# EAGLE design SensadoCalibradoMaquinas (EAGLE 9.6.2)
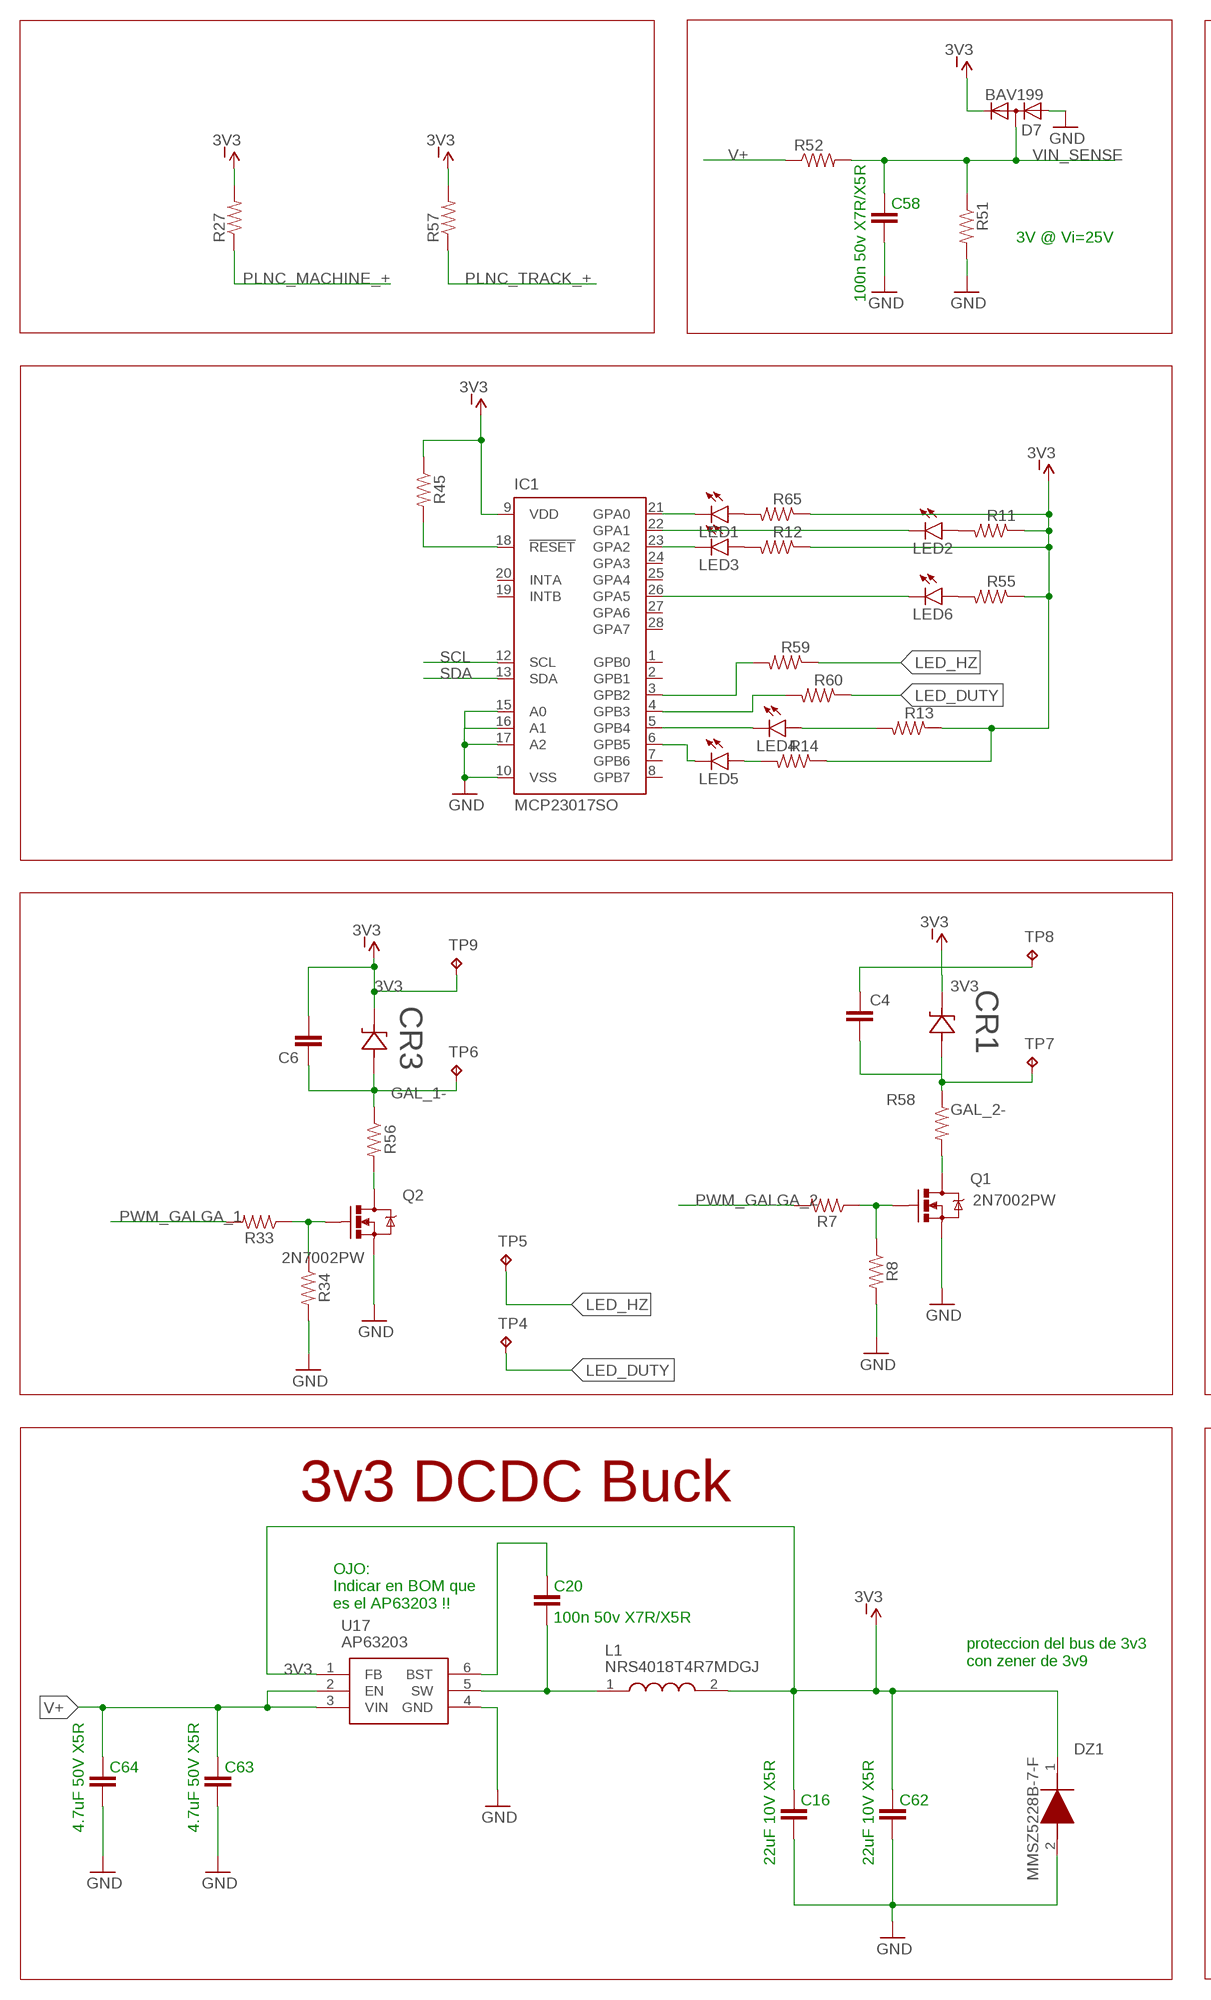
[diagram p0: schematic, sheet 1, part 1 of 2]
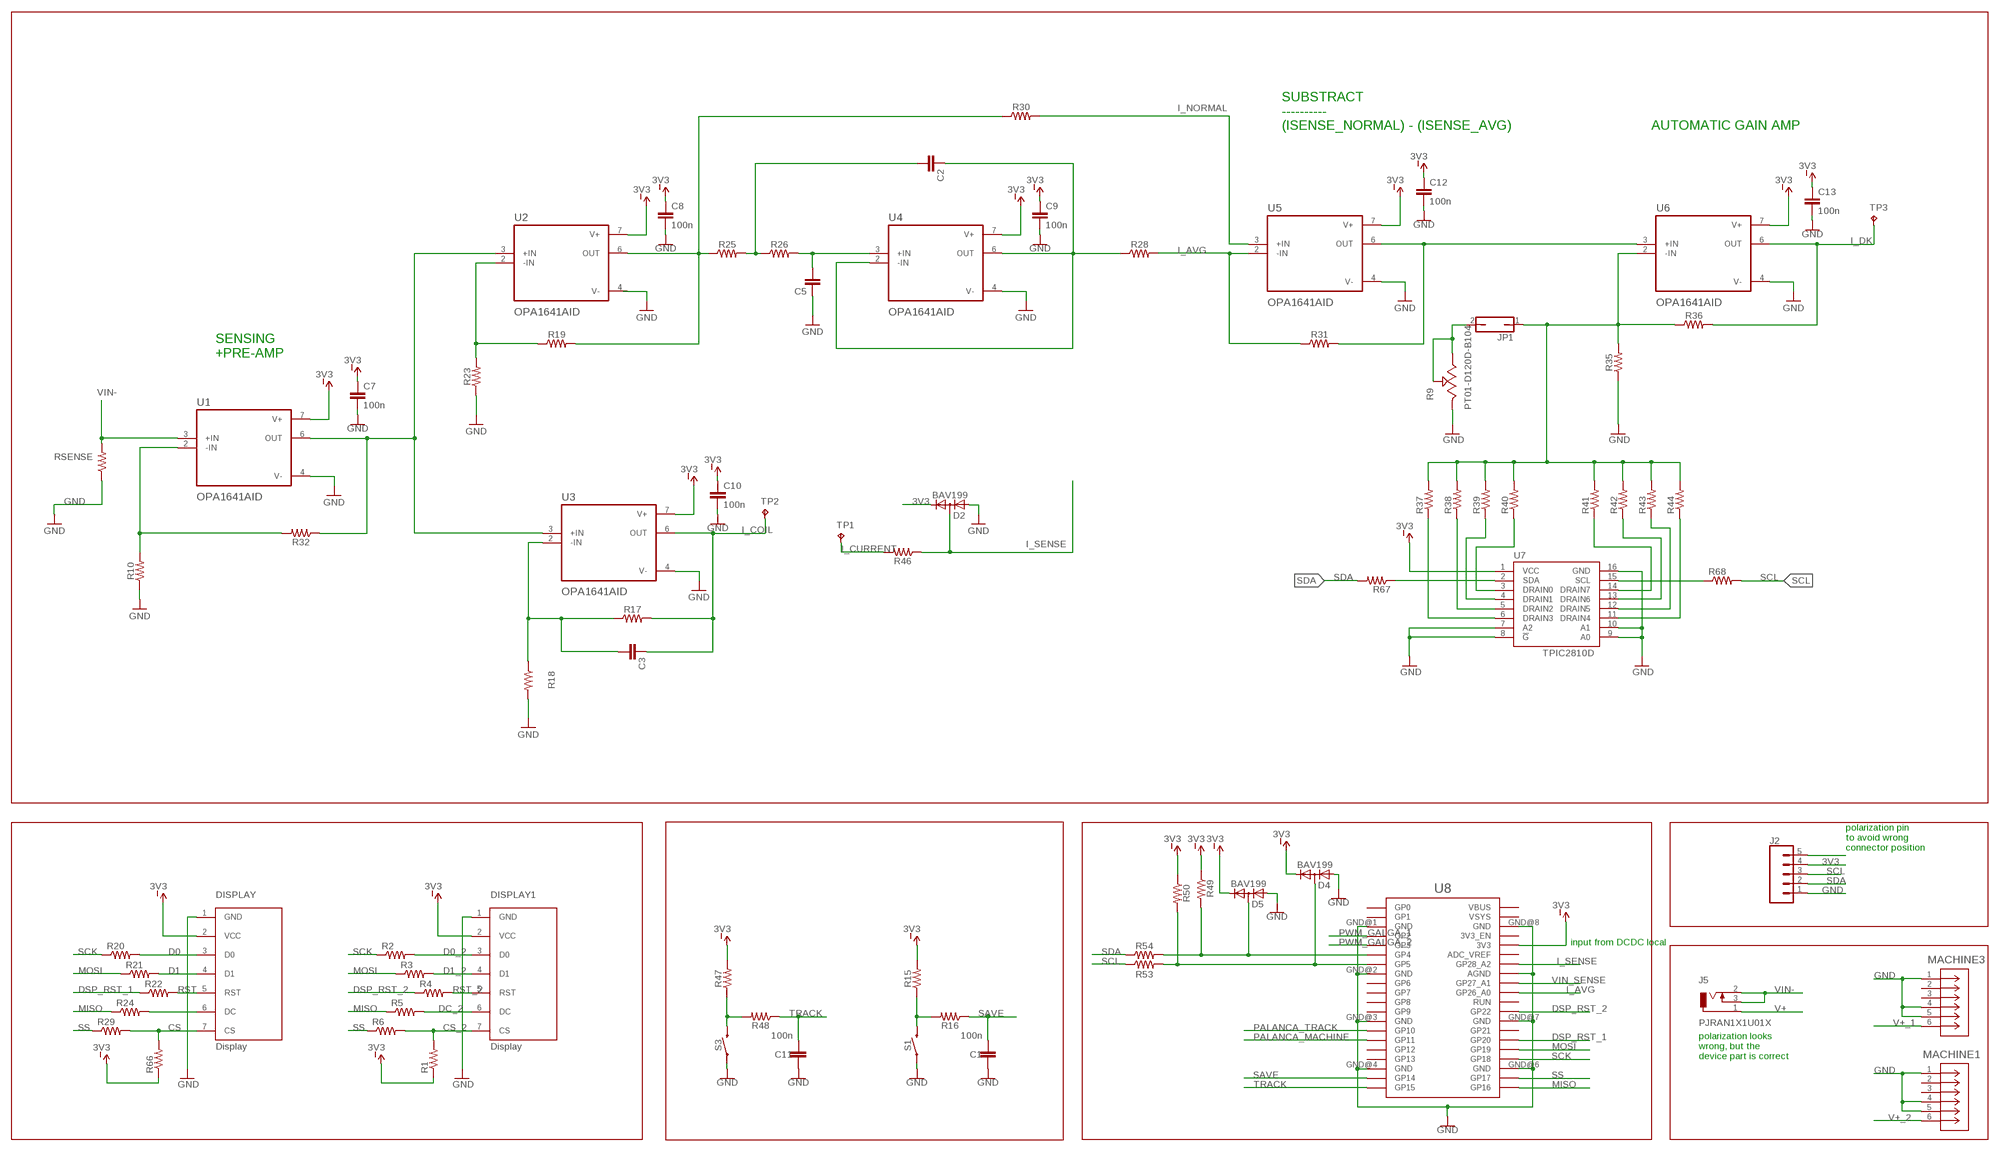
[diagram p1: schematic, sheet 1, part 2 of 2]

## Parts
C1  100n  1.0UF-0805-25V-(+80/-20%)  [0805]
C2  CAP0805  [0805]
C3  CAP0805  [0805]
C4  CAP0805  [0805]
C5  CAP0805  [0805]
C6  CAP0805  [0805]
C7  100n  1.0UF-0805-25V-(+80/-20%)  [0805]
C8  100n  1.0UF-0805-25V-(+80/-20%)  [0805]
C9  100n  1.0UF-0805-25V-(+80/-20%)  [0805]
C10  100n  1.0UF-0805-25V-(+80/-20%)  [0805]
C11  100n  1.0UF-0805-25V-(+80/-20%)  [0805]
C12  100n  1.0UF-0805-25V-(+80/-20%)  [0805]
C13  100n  1.0UF-0805-25V-(+80/-20%)  [0805]
C16  22uF 10V X5R  CAP0805  [0805]
C20  100n 50v X7R/X5R  CAP0805  [0805]
C58  100n 50v X7R/X5R  CAP0805  [0805]
C62  22uF 10V X5R  CAP0805  [0805]
C63  4.7uF 50V X5R  CAP0805  [0805]
C64  4.7uF 50V X5R  CAP0805  [0805]
CR1  STPS1L40U  [SMB_STM]
CR3  STPS1L40U  [SMB_STM]
D2  BAV199  [SOT23]
D4  BAV199  [SOT23]
D5  BAV199  [SOT23]
D7  BAV199  [SOT23]
DISPLAY  Display  OLED_LCD  [OLED_LCD]
DISPLAY1  Display  OLED_LCD  [OLED_LCD]
DZ1  MMSZ5228B-7-F  [SODFL3518X115N]
IC1  MCP23017SO  [SO28W]
J2  CONN_05  [1X05]
J5  PJRAN1X1U01X  [PJRAN1X1U01X]
JP1  JP1Q  [JP1]
L1  NRS4018T4R7MDGJ  [NRS4018T100MDGJ]
LED1  LED3MM  [LED3MM]
LED2  LED3MM  [LED3MM]
LED3  LED3MM  [LED3MM]
LED4  LED3MM  [LED3MM]
LED5  LED3MM  [LED3MM]
LED6  LED3MM  [LED3MM]
MACHINE1  ACJS-MHDR  [CONN_MHDR_AMP]
MACHINE3  ACJS-MHDR  [CONN_MHDR_AMP]
Q1  2N7002PW  MOSFET-NCHANNEL2N7002PW  [SOT323]
Q2  2N7002PW  MOSFET-NCHANNEL2N7002PW  [SOT323]
R1  RESISTOR0805  [0805]
R2  RESISTOR0805  [0805]
R3  RESISTOR0805  [0805]
R4  RESISTOR0805  [0805]
R5  RESISTOR0805  [0805]
R6  RESISTOR0805  [0805]
R7  RESISTOR0805  [0805]
R8  RESISTOR0805  [0805]
R9  PT01-D120D-B104  [TRIM_PT01-D120D-B104]
R10  RESISTOR0805  [0805]
R11  RESISTOR0805  [0805]
R12  RESISTOR0805  [0805]
R13  RESISTOR0805  [0805]
R14  RESISTOR0805  [0805]
R15  RESISTOR0805  [0805]
R16  RESISTOR0805  [0805]
R17  RESISTOR0805  [0805]
R18  RESISTOR0805  [0805]
R19  RESISTOR0805  [0805]
R20  RESISTOR0805  [0805]
R21  RESISTOR0805  [0805]
R22  RESISTOR0805  [0805]
R23  RESISTOR0805  [0805]
R24  RESISTOR0805  [0805]
R25  RESISTOR0805  [0805]
R26  RESISTOR0805  [0805]
R27  RESISTOR0805  [0805]
R28  RESISTOR0805  [0805]
R29  RESISTOR0805  [0805]
R30  RESISTOR0805  [0805]
R31  RESISTOR0805  [0805]
R32  RESISTOR0805  [0805]
R33  RESISTOR0805  [0805]
R34  RESISTOR0805  [0805]
R35  RESISTOR0805  [0805]
R36  RESISTOR0805  [0805]
R37  RESISTOR0805  [0805]
R38  RESISTOR0805  [0805]
R39  RESISTOR0805  [0805]
R40  RESISTOR0805  [0805]
R41  RESISTOR0805  [0805]
R42  RESISTOR0805  [0805]
R43  RESISTOR0805  [0805]
R44  RESISTOR0805  [0805]
R45  RESISTOR0805  [0805]
R46  RESISTOR0805  [0805]
R47  RESISTOR0805  [0805]
R48  RESISTOR0805  [0805]
R49  RESISTOR0805  [0805]
R50  RESISTOR0805  [0805]
R51  RESISTOR0805  [0805]
R52  RESISTOR0805  [0805]
R53  RESISTOR0805  [0805]
R54  RESISTOR0805  [0805]
R55  RESISTOR0805  [0805]
R56  RESISTOR0805  [0805]
R57  RESISTOR0805  [0805]
R58  RESISTOR0805  [0805]
R59  RESISTOR0805  [0805]
R60  RESISTOR0805  [0805]
R65  RESISTOR0805  [0805]
R66  RESISTOR0805  [0805]
R67  RESISTOR0805  [0805]
R68  RESISTOR0805  [0805]
RSENSE  RESISTORAXIAL-0.3  [AXIAL-0.3]
S1  MOMENTARY-SWITCH-SPST-SMD-5.2MM  [TACTILE_SWITCH_SMD_5.2MM]
S3  MOMENTARY-SWITCH-SPST-SMD-5.2MM  [TACTILE_SWITCH_SMD_5.2MM]
TP1  TPTP06SQ  [TP06SQ]
TP2  TPTP06SQ  [TP06SQ]
TP3  TPTP06SQ  [TP06SQ]
TP4  TPTP06SQ  [TP06SQ]
TP5  TPTP06SQ  [TP06SQ]
TP6  TPTP06SQ  [TP06SQ]
TP7  TPTP06SQ  [TP06SQ]
TP8  TPTP06SQ  [TP06SQ]
TP9  TPTP06SQ  [TP06SQ]
U1  OPA1641AID  [SOIC127P599X175-8N]
U2  OPA1641AID  [SOIC127P599X175-8N]
U3  OPA1641AID  [SOIC127P599X175-8N]
U4  OPA1641AID  [SOIC127P599X175-8N]
U5  OPA1641AID  [SOIC127P599X175-8N]
U6  OPA1641AID  [SOIC127P599X175-8N]
U7  TPIC2810D  [SO16]
U8  RPI_PICO_IG-TH  [RPI_PICO_TH]
U17  AP63203  AP63201WU-7  [SOT95P280X100-6N]

## Nets
3V3: C4.1 C6.2 C7.2 C8.2 C9.2 C10.2 C12.2 C13.2 C16.2 C62.2 CR1.2 CR3.2 D2.2(C) D4.2(C) D5.2(C) D7.2(C) DISPLAY1.2(VCC) DISPLAY.2(VCC) DZ1.1(K) IC1.9(VDD) J2.4 L1.2 R1.1 R11.1 R12.1 R13.1 R14.1 R15.2 R27.2 R45.1 R47.2 R49.1 R50.1 R55.1 R57.2 R65.1 R66.1 TP8.TP TP9.TP U1.7(V+) U2.7(V+) U3.7(V+) U4.7(V+) U5.7(V+) U6.7(V+) U7.1(VCC) U8.3V3 U17.1(FB)
CS: DISPLAY.7(CS) R29.2 R66.2
CS_2: DISPLAY1.7(CS) R1.2 R6.2
D0: DISPLAY.3(D0) R20.2
D0_2: DISPLAY1.3(D0) R2.2
D1: DISPLAY.4(D1) R21.2
D1_2: DISPLAY1.4(D1) R3.2
DC_2: DISPLAY1.6(DC) R5.2
DSP_RST_1: R22.1 U8.GP20
DSP_RST_2: R4.1 U8.GP22
GAIN: R32.1 U1.6(OUT) U2.3(+IN) U3.3(+IN)
GAL_1-: C6.1 CR3.1 R56.1 TP6.TP
GAL_2-: C4.2 CR1.1 R58.1 TP7.TP
GND: C1.1 C5.1 C7.1 C8.1 C9.1 C10.1 C11.1 C12.1 C13.1 C16.1 C58.1 C62.1 C63.1 C64.1 D2.1(A) D4.1(A) D5.1(A) D7.1(A) DISPLAY1.1(GND) DISPLAY.1(GND) DZ1.2(A) IC1.10(VSS) IC1.15(A0) IC1.16(A1) IC1.17(A2) J2.1 MACHINE1.1 MACHINE1.4 MACHINE1.5 MACHINE3.1 MACHINE3.4 MACHINE3.5 Q1.2(S) Q2.2(S) R8.2 R9.1 R10.1 R18.2 R23.1 R34.2 R35.1 R51.2 RSENSE.P$1 S1.1 S3.1 U1.4(V-) U2.4(V-) U3.4(V-) U4.4(V-) U5.4(V-) U6.4(V-) U7.7(A2) U7.8(!G) U7.9(A0) U7.10(A1) U7.16(GND) U8.AGND U8.GND@1(GND) U8.GND@2(GND) U8.GND@3(GND) U8.GND@4(GND) U8.GND@6(GND) U8.GND@7(GND) U8.GND@8(GND) U17.4(GND)
I_AVG: R28.2 R31.1 U5.2(-IN) U8.GP26_A0
I_COIL: C3.1 R17.2 TP2.TP U3.6(OUT)
I_CURRENT: R46.2 TP1.TP
I_DK: R36.2 TP3.TP U6.6(OUT)
I_NORMAL: R30.2 U5.3(+IN)
I_SENSE: D2.3(AC) R46.1 U8.GP28_A2
LED_DUTY: R60.1 TP4.TP
LED_HZ: R59.1 TP5.TP
MISO: R5.1 R24.1 U8.GP16
MOSI: R3.1 R21.1 U8.GP19
N$1: D5.3(AC) R49.2 R54.2 U8.GP4
N$2: Q2.1(G) R33.1 R34.1
N$3: Q1.1(G) R7.1 R8.1
N$4: R10.2 R32.2 U1.2(-IN)
N$5: R31.2 U5.6(OUT) U6.3(+IN)
N$6: LED1.A R65.2
N$7: DISPLAY.6(DC) R24.2
N$8: IC1.22(GPA1) LED2.K(C)
N$9: LED2.A R11.2
N$10: IC1.23(GPA2) LED3.K(C)
N$11: LED4.A R13.2
N$12: IC1.5(GPB4) LED4.K(C)
N$13: LED5.A R14.2
N$14: IC1.6(GPB5) LED5.K(C)
N$15: R15.1 R16.2 S1.3
N$16: JP1.1 R35.2 R36.1 R37.2 R38.2 R39.2 R40.2 R41.2 R42.2 R43.2 R44.2 U6.2(-IN)
N$17: R37.1 U7.6(DRAIN3)
N$18: R38.1 U7.5(DRAIN2)
N$19: R39.1 U7.4(DRAIN1)
N$20: R40.1 U7.3(DRAIN0)
N$21: R41.1 U7.14(DRAIN7)
N$22: R42.1 U7.13(DRAIN6)
N$23: R43.1 U7.12(DRAIN5)
N$24: R44.1 U7.11(DRAIN4)
N$25: IC1.3(GPB2) R59.2
N$26: R68.1 U7.15(SCL)
N$27: IC1.4(GPB3) R60.2
N$28: LED6.A R55.2
N$29: C2.1 R28.1 U4.2(-IN) U4.6(OUT)
N$30: C2.2 R25.2 R26.1
N$31: C5.2 R26.2 U4.3(+IN)
N$32: R19.2 R25.1 R30.1 U2.6(OUT)
N$33: R19.1 R23.2 U2.2(-IN)
N$34: C3.2 R17.1 R18.1 U3.2(-IN)
N$36: D4.3(AC) R50.2 R53.2 U8.GP5
N$37: IC1.26(GPA5) LED6.K(C)
N$38: R47.1 R48.2 S3.3
N$39: J2.5
N$40: R67.1 U7.2(SDA)
N$41: Q2.3(D) R56.2
N$42: LED3.A R12.2
N$44: Q1.3(D) R58.2
N$45: IC1.18(!RESET) R45.2
N$46: JP1.2 R9.2 R9.3
N$59: IC1.21(GPA0) LED1.K(C)
N$69: C20.2 U17.6(BST)
N$70: C20.1 L1.1 U17.5(SW)
PALANCA_MACHINE: U8.GP11
PALANCA_TRACK: U8.GP10
PLNC_MACHINE_+: R27.1
PLNC_TRACK_+: R57.1
PWM_GALGA_1: R33.2 U8.GP2
PWM_GALGA_2: R7.2 U8.GP3
RST: DISPLAY.5(RST) R22.2
RST_2: DISPLAY1.5(RST) R4.2
SAVE: C1.2 R16.1 U8.GP14
SCK: R2.1 R20.1 U8.GP18
SCL: IC1.12(SCL) J2.3 R53.1 R68.2
SDA: IC1.13(SDA) J2.2 R54.1 R67.2
SS: R6.1 R29.1 U8.GP17
TRACK: C11.2 R48.1 U8.GP15
V+: C63.2 C64.2 J5.1 R52.1 U17.2(EN) U17.3(VIN)
V+_1: MACHINE3.6
V+_2: MACHINE1.6
VIN-: J5.2 J5.3 RSENSE.P$2 U1.3(+IN)
VIN_SENSE: C58.2 D7.3(AC) R51.1 R52.2 U8.GP27_A1
Unconnected: IC1.1(GPB0) IC1.2(GPB1) IC1.7(GPB6) IC1.8(GPB7) IC1.19(INTB) IC1.20(INTA) IC1.24(GPA3) IC1.25(GPA4) IC1.27(GPA6) IC1.28(GPA7) MACHINE1.2 MACHINE1.3 MACHINE3.2 MACHINE3.3 U8.3V3_EN U8.ADC_VREF U8.GP0 U8.GP1 U8.GP6 U8.GP7 U8.GP8 U8.GP9 U8.GP12 U8.GP13 U8.GP21 U8.RUN U8.VBUS U8.VSYS

## Notes on the sheet
- SUBSTRACT
  ----------
  (ISENSE_NORMAL) - (ISENSE_AVG)
- AUTOMATIC GAIN AMP
- 3V @ Vi=25V
- SENSING
  +PRE-AMP
- polarization pin
  to avoid wrong
  connector position
- 3v3 DCDC Buck
- OJO:
  Indicar en BOM que 
  es el AP63203 !!
- input from DCDC local
- proteccion del bus de 3v3
  con zener de 3v9
- polarization looks
  wrong, but the 
  device part is correct

## Library data of the parts
C1 C7-C13 = SparkFun-Capacitors:1.0UF: 1µF ceramic capacitors A capacitor is a passive two-terminal electrical component used to store electrical energy temporarily in an electric field.; PROD_ID: CAP-11625; VALUE: 1.0uF
C2-C6 C16 C20 C58 C62-C64 = SparkFun-Passives:CAP: Capacitor Standard 0603 ceramic capacitor, and 0.1" leaded capacitor.
CR1 CR3 = STPS1L40U:STPS1L40U; COPYRIGHT: Copyright (C) 2024 Ultra Librarian. All rights reserved.; MANUFACTURER_PART_NUMBER: STPS1L40U; MFR_NAME: STMicroelectronics
D2 D4 D5 D7 = diode:BAV199: DIODE low-leakage double diode
DISPLAY DISPLAY1 = EDCPSU:OLED_LCD
DZ1 = MMSZ5228B-7-F:MMSZ5228B-7-F: Diodes Inc MMSZ5228B-7-F Zener Diode, 3.9V 5% 500 mW SMT 2-Pin SOD-123 Source: Datasheet <http://au.rs-online.com/web/p/products/8231502P>; DESCRIPTION: Diodes Inc MMSZ5228B-7-F Zener Diode, 3.9V 5% 500 mW SMT 2-Pin SOD-123; HEIGHT: 1.15mm; MANUFACTURER_NAME: Diodes Inc.; MANUFACTURER_PART_NUMBER: MMSZ5228B-7-F
IC1 = adafruit:MCP23017: http://ww1.microchip.com/downloads/en/DeviceDoc/21952a.pdf Source: http://ww1.microchip.com/downloads/en/DeviceDoc/21952a.pdf
J2 = SparkFun-Connectors:CONN_05: Multi connection point. Often used as Generic Header-pin footprint for 0.1 inch spaced/style header connections On any of the 0.1 inch spaced packages, you can populate with these: Break Away Headers - Straight <https://www.sparkfun.com/products/116> (PRT-00116) Break Away Male Headers - Right Angle <https://www.sparkfun.com/products/553> (PRT-00553) Female Headers <https://www.sparkfun.com/products/115> (PRT-00115) Break Away Headers - Machine Pin <https://www.sparkfun.com/products/117> (PRT-00117) Break Away Female Headers - Swiss Machine Pin <https://www.sparkfun.com/products/743> (PRT-00743) For SCREWTERMINALS and SPRING TERMINALS visit here: Screw Terimnals on SparkFun.com <https://www.sparkfun.com/search/results?term=Screw+Terminals> (5mm/3.5mm/2.54mm spacing) This device is also useful as a general connection point to wire up your design to another part of your project. Our various solder wires solder well into these plated through hole pads. Hook-Up Wire - Assortment (Stranded, 22 AWG) <https://www.sparkfun.com/products/11375> (PRT-11375) Hook-Up Wire - Assortment (Solid Core, 22 AWG) <https://www.sparkfun.com/products/11367> (PRT-11367) View the entire wire category on our website here <https://www.sparkfun.com/categories/141> Special notes: Molex polarized connector foot print use with SKU : PRT-08231 with associated crimp pins and housings. 1MM SMD Version SKU: PRT-10208
J5 = Connectors:PJRAN1X1U01X: CONN RCA JACK MONO 3.2MM R/A Manufacturer's datasheet <http://www.switchcraft.com/Drawings/pjran1x1u__x_series_cd.pdf>; CREATED_BY: PCBLayout.com; DIGIKEY_PART_NUMBER: PJRAN1X1U01X-ND; MANUFACTURER: Switchcraft Inc.; MPN: PJRAN1X1U01X
JP1 = jumper:JP1Q: JUMPER
L1 = NRS4018T4R7MDGJ:NRS4018T4R7MDGJ: Inductor SMD wirewound 4.7uH Source: Datasheet <https://datasheet.datasheetarchive.com/originals/distributors/Datasheets-DGA11/2190982.pdf>; ARROW_PART_NUMBER: NRS4018T4R7MDGJ; ARROW_PRICE-STOCK: https://www.arrow.com/en/products/nrs4018t4r7mdgj/taiyo-yuden; DESCRIPTION: Inductor SMD wirewound 4.7uH; HEIGHT: 1mm; MANUFACTURER_NAME: TAIYO YUDEN; MANUFACTURER_PART_NUMBER: NRS4018T4R7MDGJ; MOUSER_PART_NUMBER: 963-NRS4018T4R7MDGJ; MOUSER_PRICE-STOCK: https://www.mouser.co.uk/ProductDetail/Taiyo-Yuden/NRS4018T4R7MDGJ?qs=PzICbMaShUfBUWy4ytltsA%3D%3D
LED1-LED6 = SparkFun-LED:LED: LEDs Standard schematic elements and footprints for 5mm, 3mm, 1206, and 0603 sized LEDs. 5mm - Spark Fun Electronics SKU : COM-00529 (and others)
MACHINE1 MACHINE3 = ACJSMHDR:ACJS-MHDR; BUILT_BY: EMA_Matt; COPYRIGHT: Copyright (C) 2018 Accelerated Designs. All rights reserved; MANUFACTURER_PART_NUMBER: ACJS-MHDR; SOURCELIBRARY: Amphenol_2019-10-30; VENDOR: Amphenol
Q1 Q2 = SparkFun-DiscreteSemi:MOSFET-NCHANNEL: Common NMOSFET Parts MFG P/N Store ID Prod ID FDD8780 TRANS-09984 SI7820DN TRANS-11055 FDS6630A IC-08089 2N7002PW TRANS-11151 FQP30N06L COM-10213 TRANS-10060 BSS123LT1G TRANS-08345 BSS138 TRANS-00830 BS170 2N7000; PROD_ID: TRANS-11151
R1-R8 R10-R60 R65-R68 RSENSE = SparkFun-Resistors:RESISTOR: Generic Resistor Package
R9 = PT01-D120D-B104:PT01-D120D-B104; MANUFACTURER: CUI Devices; MAXIMUM_PACKAGE_HEIGHT: 26.8 mm; PARTREV: 1.0; STANDARD: Manufacturer Recommendations
S1 S3 = SparkFun-Switches:MOMENTARY-SWITCH-SPST: Momentary Switch (Pushbutton) - SPST Normally-open (NO) SPST momentary switches (buttons, pushbuttons). Variants PTH-12MM - 12mm square, through-hole Momentary Pushbutton Switch - 12mm Square <https://www.sparkfun.com/products/9190> (COM-09190) PTH-6.0MM, PTH-6.0MM-KIT - 6.0mm square, through-hole Mini Pushbutton Switch <https://www.sparkfun.com/products/97> (COM-00097) KIT package intended for soldering kit's - only one side of pads' copper is exposed. PTH-RIGHT-ANGLE-KIT - Right-angle, through-hole Right Angle Tactile Button <https://www.sparkfun.com/products/10791> - Used on SparkFun BigTime Watch Kit <https://www.sparkfun.com/products/11734> SMD-12MM - 12mm square, surface-mount Tactile Button - SMD (12mm) <https://www.sparkfun.com/products/12993> (COM-12993) Used on SparkFun PicoBoard <https://www.sparkfun.com/products/11888> SMD-4.5MM - 4.5mm Square Trackball Switch Used on SparkFun Blackberry Trackballer Breakout <https://www.sparkfun.com/products/13169> SMD-4.6MMX2.8MM - 4.60mm x 2.80mm, surface mount Used on SparkFun SAMD21 Mini Breakout <https://www.sparkfun.com/products/13664> SMD-5.2MM, SMD-5.2-REDUNDANT - 5.2mm square, surface-mount Mini Pushbutton Switch - SMD <https://www.sparkfun.com/products/8720> (COM-08720) Used on Arduino Pro Mini <https://www.sparkfun.com/products/11114> REDUNDANT package connects both switch circuits together SMD-6.0X3.5MM - 6.0 x 3.5mm, surface mount Momentary Reset Switch SMD <https://www.sparkfun.com/products/8229> (COM-08229) SMD-6.2MM-TALL - 6.2mm square, surface mount Tactile Button - SMD (6mm) <https://www.sparkfun.com/products/12992> Used on SparkFun Digital Sandbox <https://www.sparkfun.com/products/12651> SMD-RIGHT-ANGLE - Right-angle, surface mount Used on SparkFun Block for Intel® Edison - Arduino <https://www.sparkfun.com/products/13036>; PROD_ID: SWCH-08247; SF_SKU: COM-08720
TP1-TP9 = testpad:TP: Test pad
U1-U6 = OPA1641AID:OPA1641AID
U7 = EDCPSU - Rev2:TPIC2810D
U8 = RaspberryPi_Pico:RPI_PICO_IG
U17 = AP63201WU-7:AP63201WU-7: Switching Voltage Regulators DCDC Conv HV Buck TSOT26 T&R 3K Source: Datasheet <https://mouser.componentsearchengine.com/Datasheets/1/AP63201WU-7.pdf>; ARROW_PART_NUMBER: AP63201WU-7; ARROW_PRICE-STOCK: https://www.arrow.com/en/products/ap63201wu-7/diodes-incorporated?region=nac; DESCRIPTION: Switching Voltage Regulators DCDC Conv HV Buck TSOT26 T&R 3K; HEIGHT: 1mm; MANUFACTURER_NAME: Diodes Inc.; MANUFACTURER_PART_NUMBER: AP63201WU-7; MOUSER_PART_NUMBER: 621-AP63201WU-7; MOUSER_PRICE-STOCK: https://www.mouser.co.uk/ProductDetail/Diodes-Incorporated/AP63201WU-7?qs=u16ybLDytRaVD%252BU3eG30NA%3D%3D

## Board
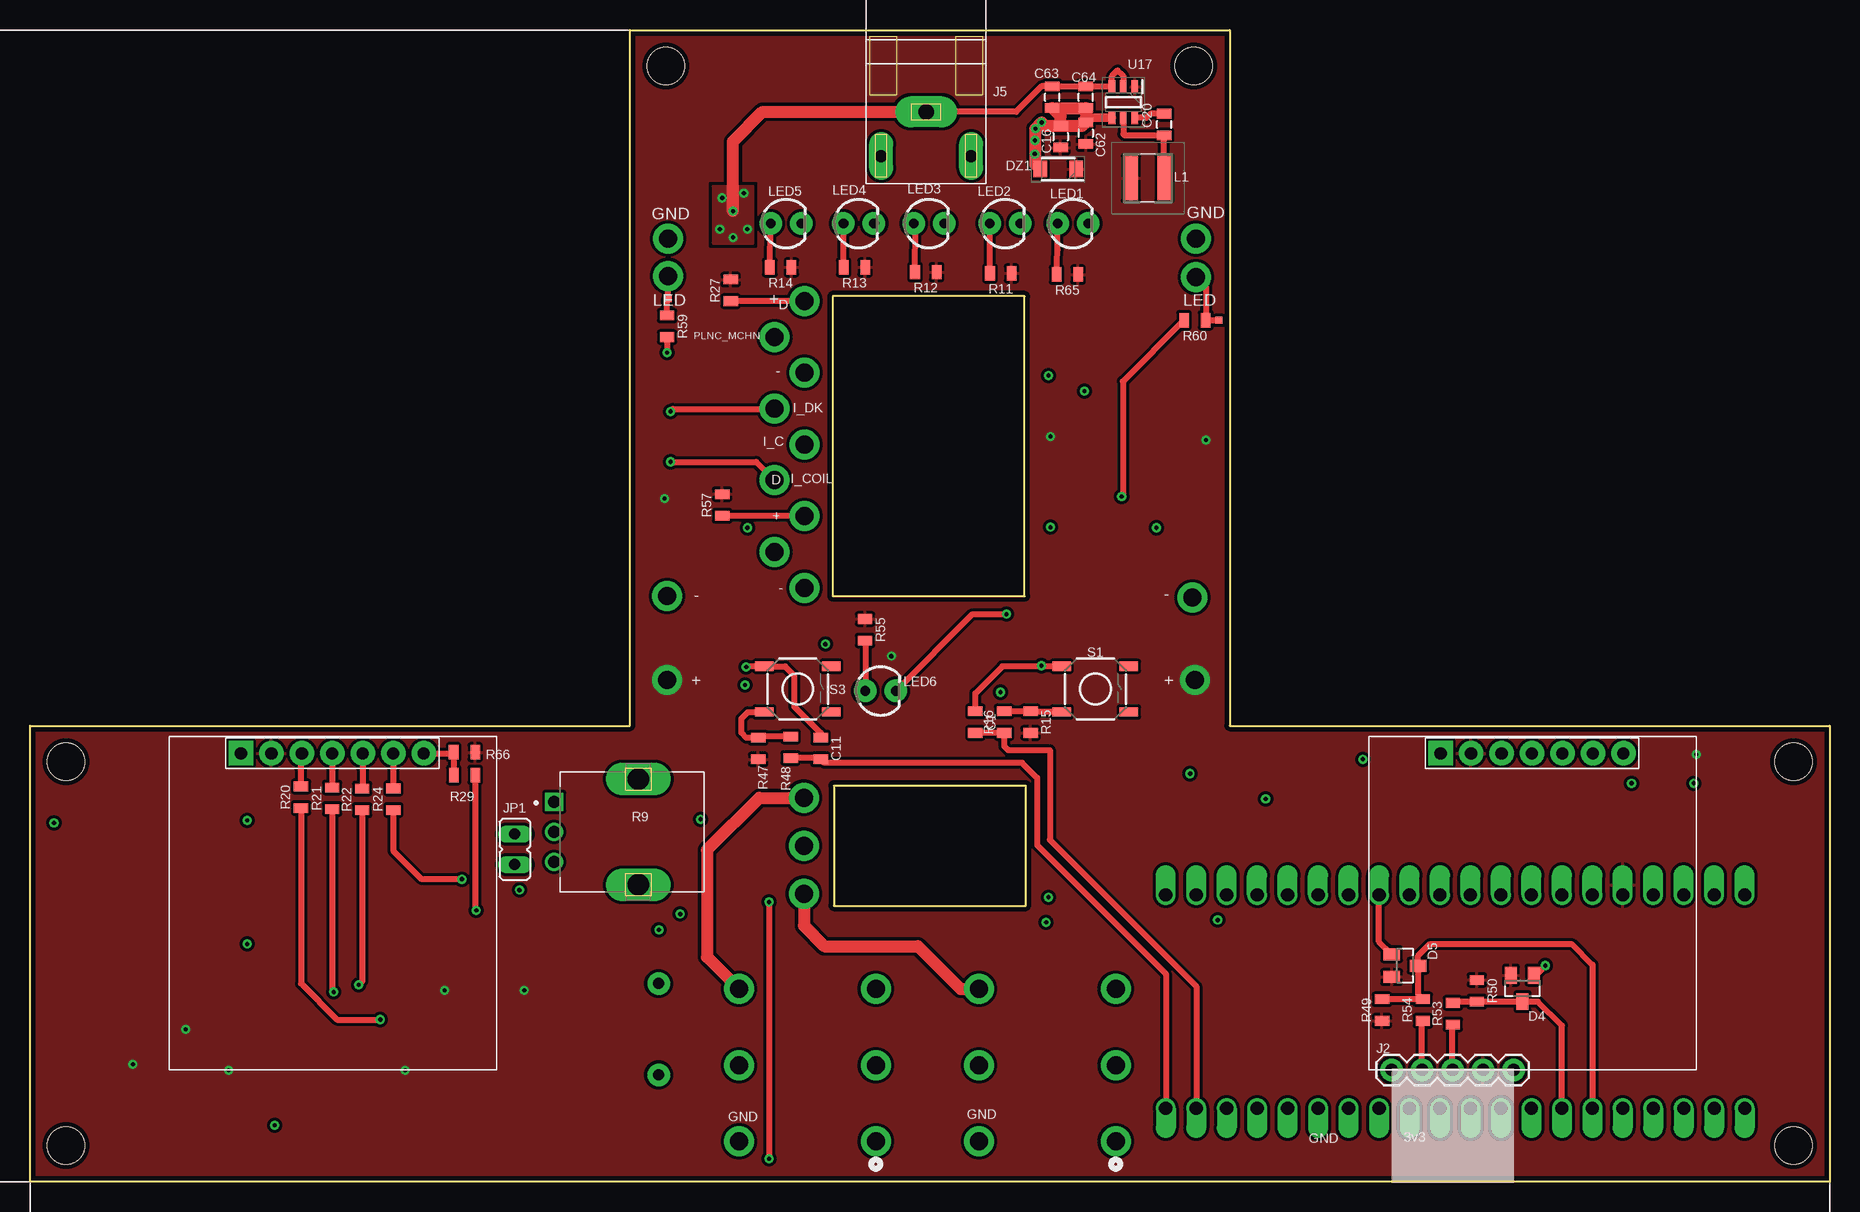
[diagram p2: board, top side]
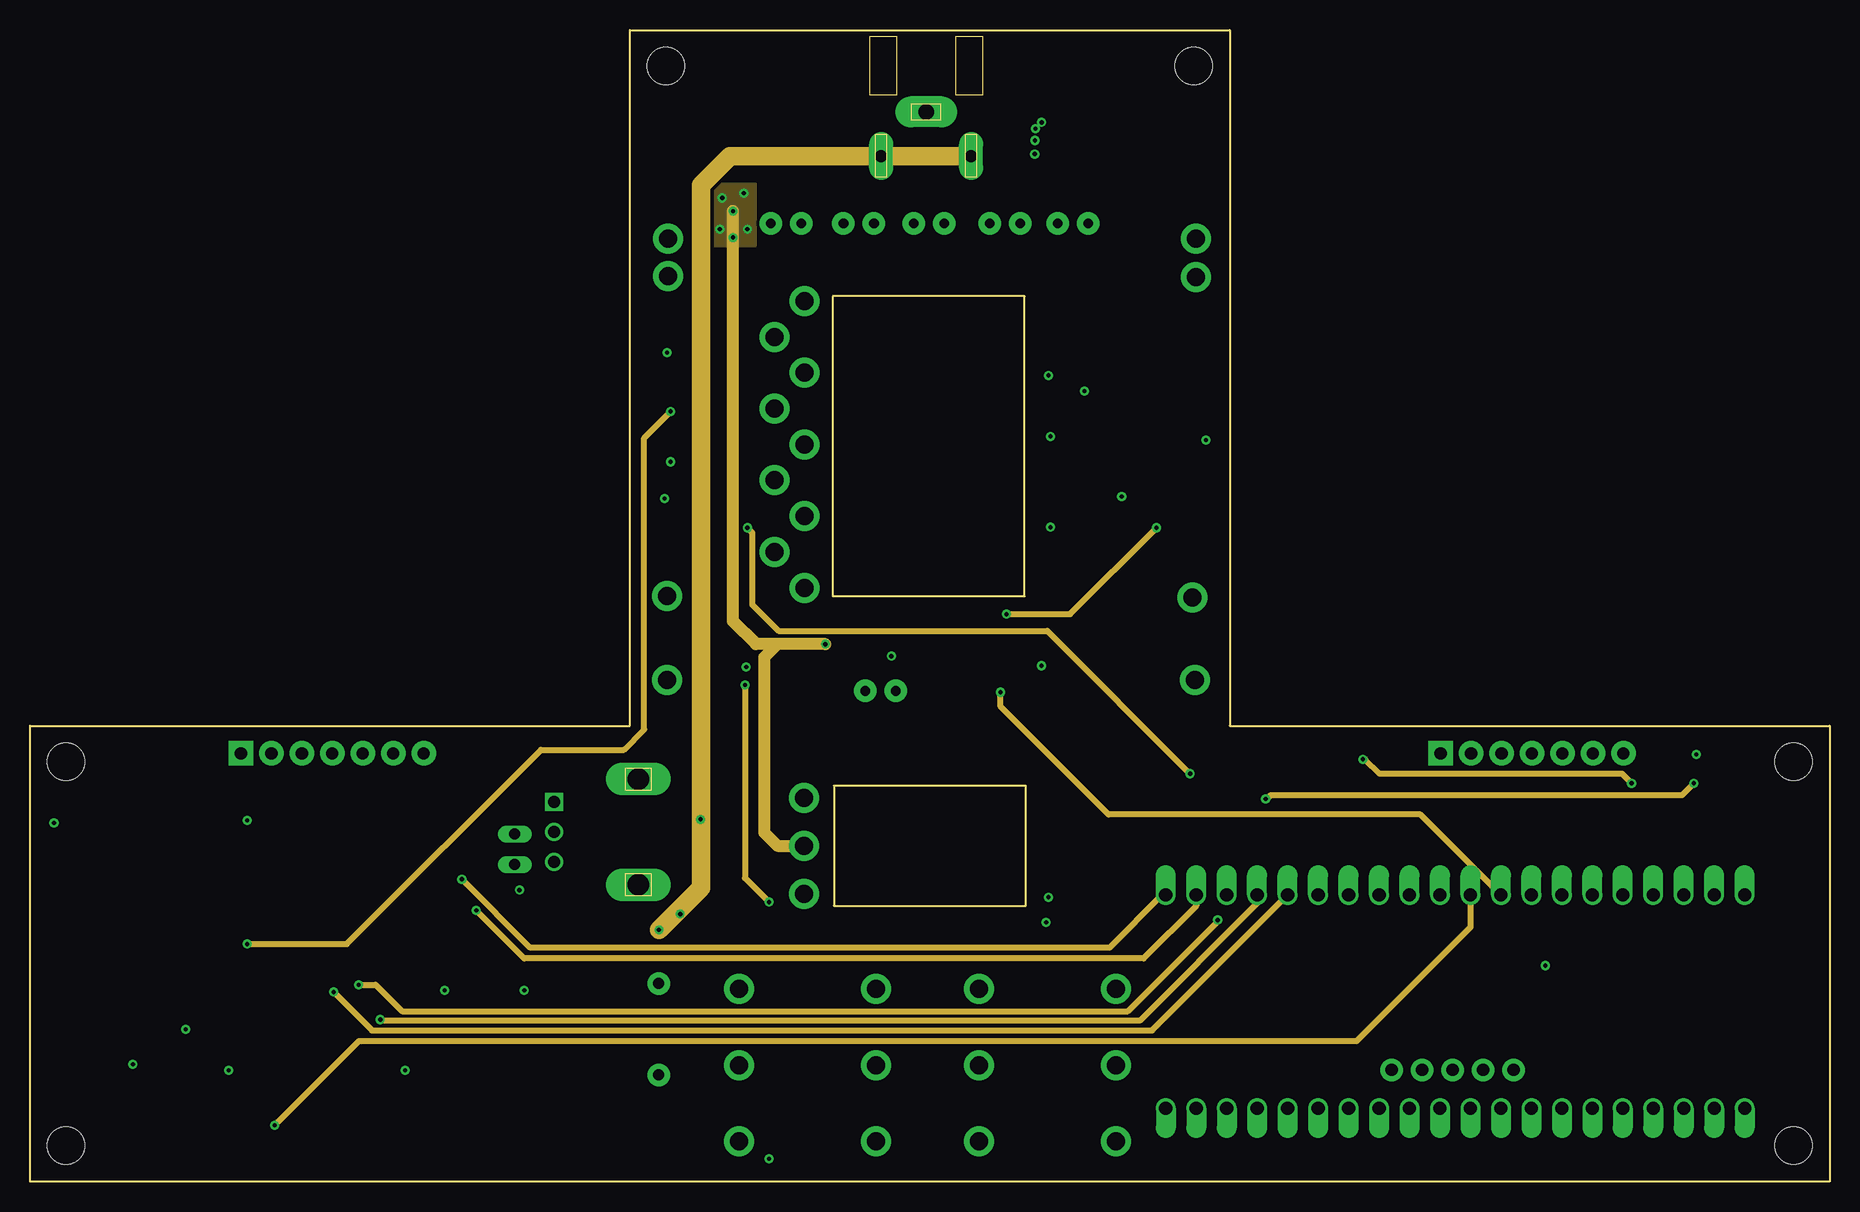
[diagram p3: board, inner layer Route2]
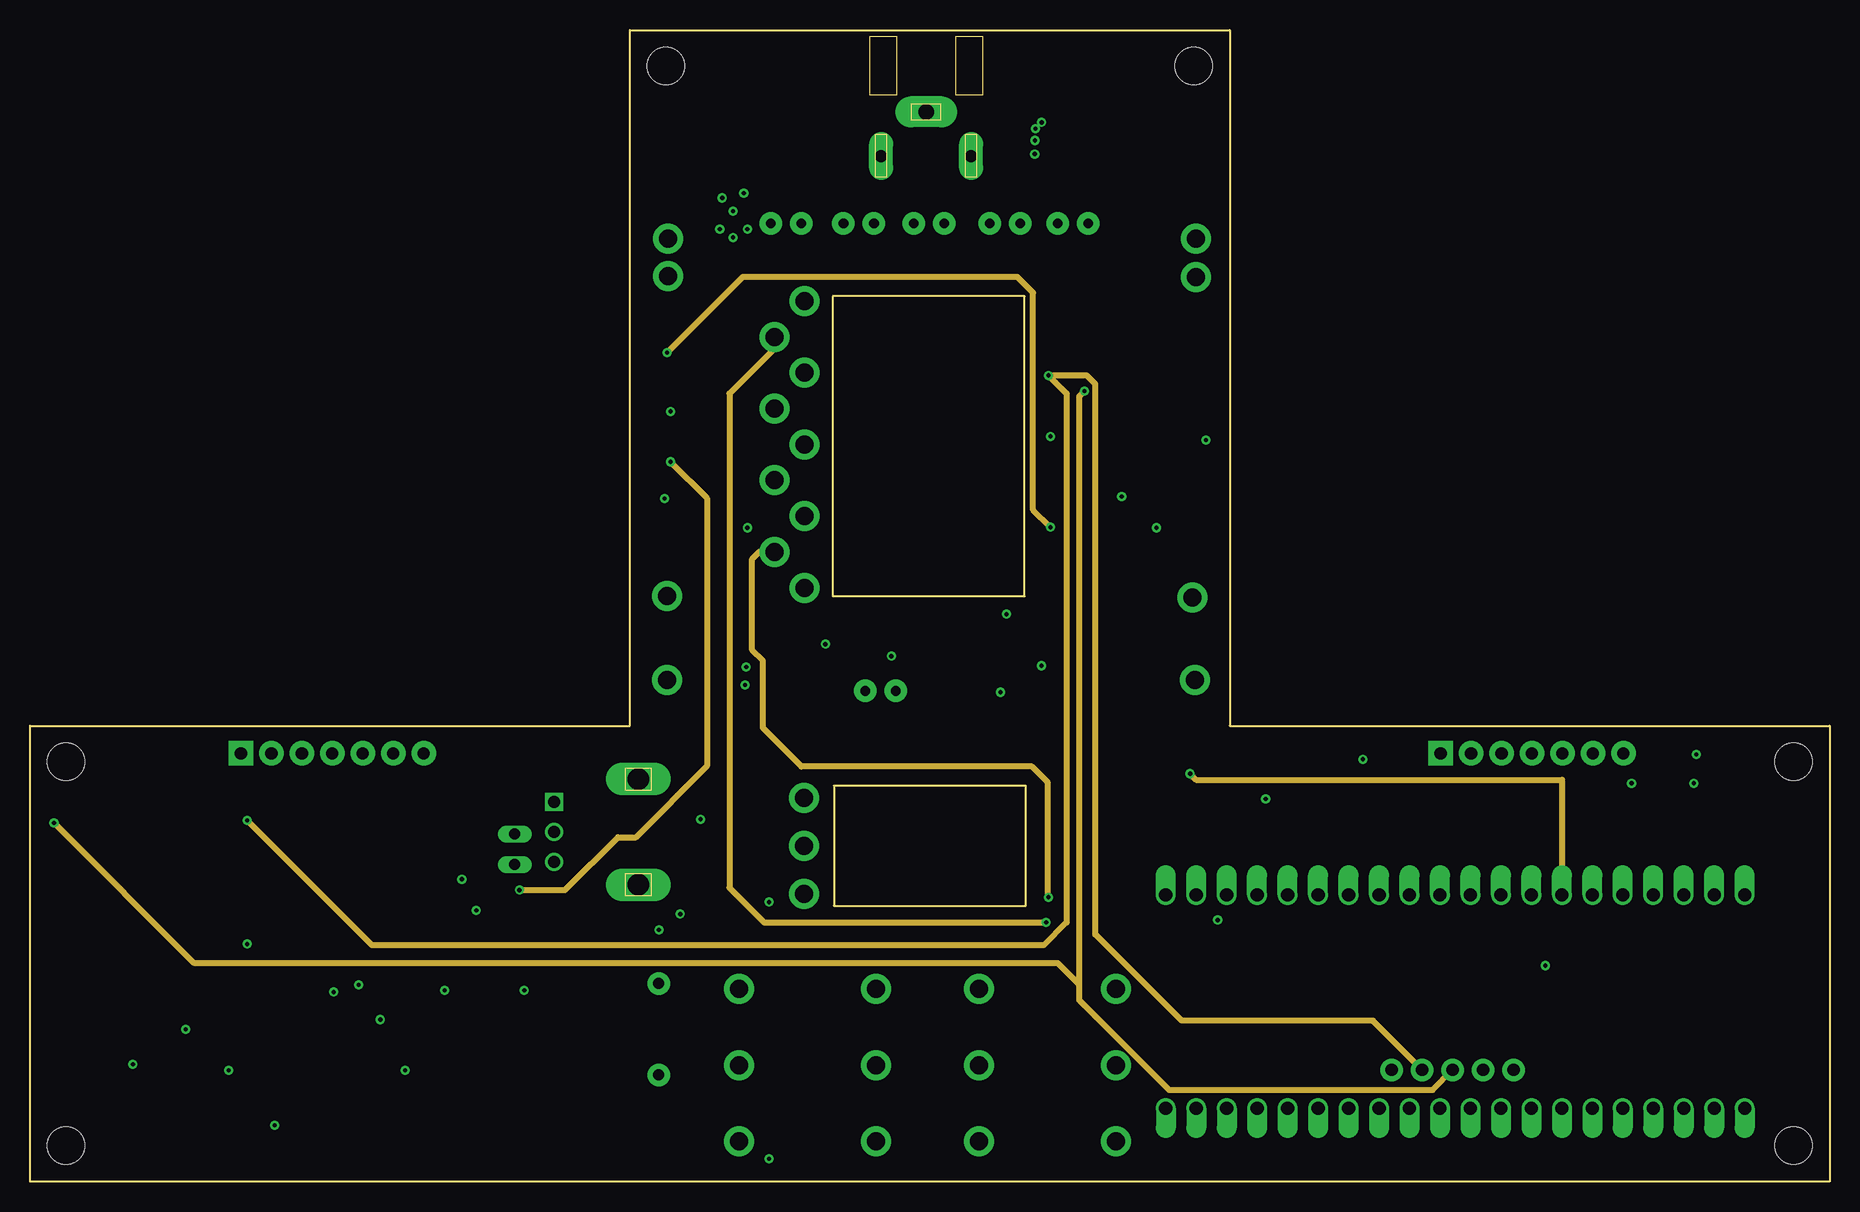
[diagram p4: board, inner layer Route15]
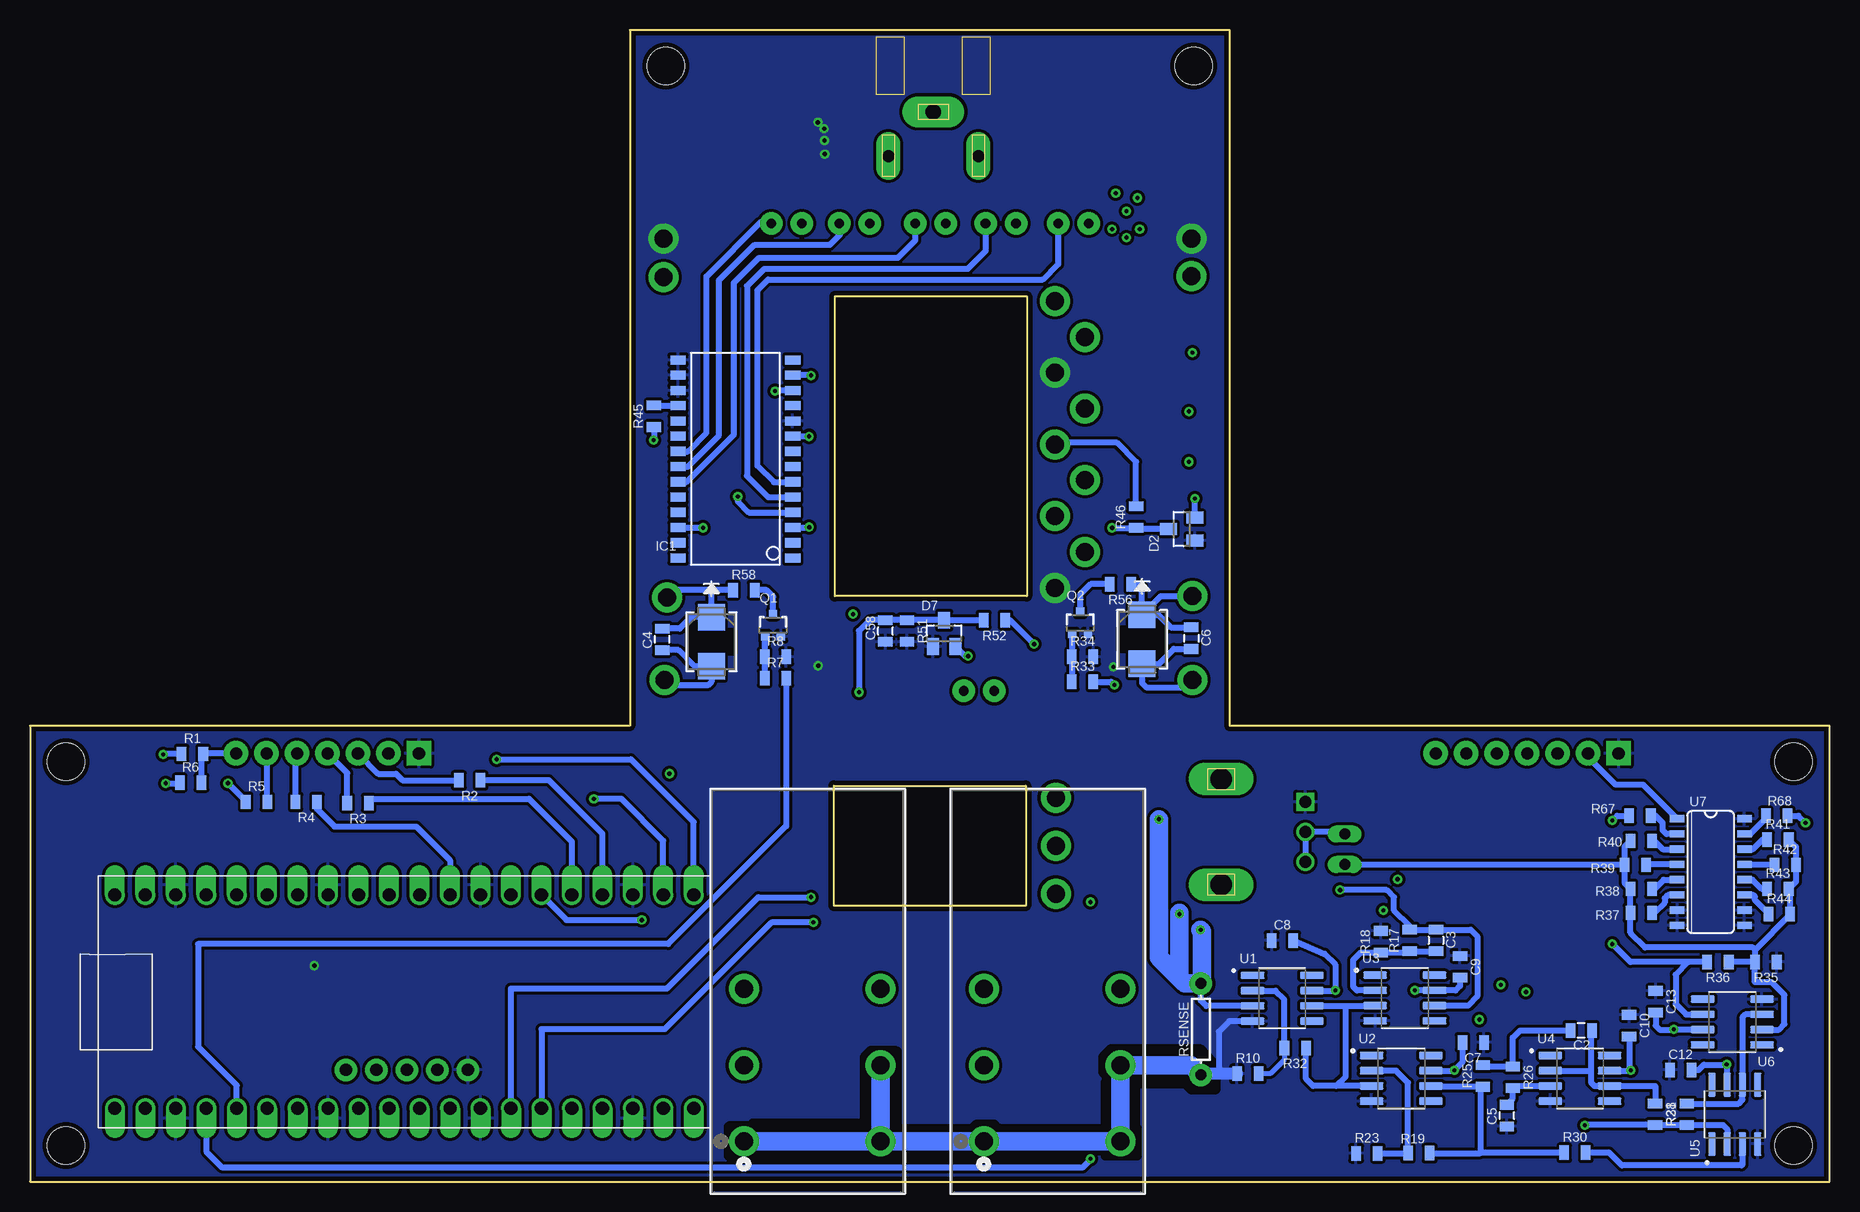
[diagram p5: board, bottom side, seen from below]

Size 150 x 96 mm. Coordinates in mm from the lower left corner, seen from the top.
Outline: 150,0 0,0 0,38 50,38 50,96 100,96 100,38 150,38 150,0
Outline: 82.9,48.8 82.9,73.8 66.9,73.8 66.9,48.8 82.9,48.8
Outline: 83,33 67,33 67,23 83,23 83,33
Copper layers (1+2*15+16): Top 0.035mm / dielectric 1.5mm / Route2 0.035mm / dielectric 0.15mm / Route15 0.035mm / dielectric 0.2mm / Bottom 0.035mm
Design rules "default *": minimum track width 6mil, minimum drill 0.35mm, track to track 10mil, track to pad 10mil, pad to pad 10mil, via to via 10mil, smd to smd 6mil, copper to edge 15mil, drill to drill 6mil, minimum pad ring 10mil, minimum via ring 8mil, stop-mask expansion 4mil, vias tented up to drill 0mil, thermal gap 10mil
Holes 3.1 mm at 147,35.01 147,3 3,3 3,35.01 53.01,93 97,93
bRestrict: area 51.1,7.6 to 53.9,10.8; area 57.6,8.3 to 60.6,11.1; area 57.7,2.1 to 60.4,4.7; area 69.2,2.1 to 71.8,4.8; area 77.7,2.1 to 80.5,11; area 89.1,2.1 to 91.8,4.7; area 52.2,8.1 to 59.6,11.1; area 57.8,4.4 to 60.4,8.3; area 57.7,2.1 to 78.6,4.7; area 80.1,1.9 to 89.8,4.9

### Footprints (pad centres in the part's own frame; a part is rotated, then mirrored left to right if it is on the bottom)
0805 = smd 0.8 x 1.2: 1 -0.9,0; 2 0.9,0
SMB_STM = smd 2.21 x 2.261: 1 -2.045,0; 2 2.045,0
SOT23 = smd 1 x 1.4: 1 -0.95,-1.1; 2 0.95,-1.1; 3 0,1.1
OLED_LCD = drill 1.016 pad 2.032 square: 1 -7.42,13.7 | drill 1.016 pad 2.032: 2 -4.88,13.7; 3 -2.34,13.7; 4 0.2,13.7; 5 2.74,13.7; 6 5.28,13.7; 7 7.82,13.7
SODFL3518X115N = smd 1.12 x 1.37: 1 -1.5,0; 2 1.5,0
SO28W = smd 0.762 x 1.27: 1 -7.62,-4.78; 2 -6.35,-4.78; 3 -5.08,-4.78; 4 -3.81,-4.78; 5 -2.54,-4.78; 6 -1.27,-4.78; 7 0,-4.78; 8 1.27,-4.78; 9 2.54,-4.78; 10 3.81,-4.78; 11 5.08,-4.78; 12 6.35,-4.78; 13 7.62,-4.78; 14 8.89,-4.78; 15 8.89,4.78; 16 7.62,4.78; 17 6.35,4.78; 18 5.08,4.78; 19 3.81,4.78; 20 2.54,4.78; 21 1.27,4.78; 22 0,4.78; 23 -1.27,4.78; 24 -2.54,4.78; 25 -3.81,4.78; 26 -5.08,4.78; 27 -6.35,4.78; 28 -7.62,4.78
1X05 = drill 1.016 pad 1.88: 1 0,0; 2 2.54,0; 3 5.08,0; 4 7.62,0; 5 10.16,0
PJRAN1X1U01X = drill 1.3 pad 2.6 long: 1 0,0 | drill 1 pad 2 long: 2 3.75,3.7; 3 -3.75,3.7
JP1 = drill 0.914 long: 1 0,-1.27; 2 0,1.27
NRS4018T100MDGJ = smd 1.2 x 3.7: 1 -1.4,0; 2 1.4,0
LED3MM = drill 0.813 pad 1.88: A -1.27,0; K 1.27,0
CONN_MHDR_AMP = drill 1.5 pad 2.5: 1 0,0; 2 -6.35,0; 3 -12.7,0; 4 0,11.405; 5 -6.35,11.405; 6 -12.7,11.405
SOT323 = smd 0.7 x 0.7: 1 -0.65,-0.925; 2 0.65,-0.925; 3 0,0.925
TRIM_PT01-D120D-B104 = drill 1 square: 1 -2.5,-7 | drill 1: 2 0,-7; 3 2.5,-7 | drill 1.8 pad 2.3 long: S1 -4.4,0; S2 4.4,0
AXIAL-0.3 = drill 0.9 pad 1.88: P$1 -3.81,0; P$2 3.81,0
TACTILE_SWITCH_SMD_5.2MM = smd 1.524 x 0.762: 1 -2.794,1.905; 2 2.794,1.905; 3 -2.794,-1.905; 4 2.794,-1.905
TP06SQ = smd 0.6 x 0.6: TP 0,0
SOIC127P599X175-8N = smd 1.97 x 0.6: 1 -2.47,1.905; 2 -2.47,0.635; 3 -2.47,-0.635; 4 -2.47,-1.905; 5 2.47,-1.905; 6 2.47,-0.635; 7 2.47,0.635; 8 2.47,1.905
SO16 = smd 0.6 x 1.2: 1 -4.445,-2.8; 2 -3.175,-2.8; 3 -1.905,-2.8; 4 -0.635,-2.8; 5 0.635,-2.8; 6 1.905,-2.8; 7 3.175,-2.8; 8 4.445,-2.8; 9 4.445,2.8; 10 3.175,2.8; 11 1.905,2.8; 12 0.635,2.8; 13 -0.635,2.8; 14 -1.905,2.8; 15 -3.175,2.8; 16 -4.445,2.8
RPI_PICO_TH = drill 1.1 pad 1.6 offset: 3V3 8.89,13.97; 3V3_EN 8.89,16.51; ADC_VREF 8.89,11.43; AGND 8.89,6.35; GND@1 -8.89,19.05; GND@2 -8.89,6.35; GND@3 -8.89,-6.35; GND@4 -8.89,-19.05; GND@6 8.89,-19.05; GND@7 8.89,-6.35; GND@8 8.89,19.05; GP0 -8.89,24.13; GP1 -8.89,21.59; GP2 -8.89,16.51; GP3 -8.89,13.97; GP4 -8.89,11.43; GP5 -8.89,8.89; GP6 -8.89,3.81; GP7 -8.89,1.27; GP8 -8.89,-1.27; GP9 -8.89,-3.81; GP10 -8.89,-8.89; GP11 -8.89,-11.43; GP12 -8.89,-13.97; GP13 -8.89,-16.51; GP14 -8.89,-21.59; GP15 -8.89,-24.13; GP16 8.89,-24.13; GP17 8.89,-21.59; GP18 8.89,-16.51; GP19 8.89,-13.97; GP20 8.89,-11.43; GP21 8.89,-8.89; GP22 8.89,-3.81; GP26_A0 8.89,1.27; GP27_A1 8.89,3.81; GP28_A2 8.89,8.89; RUN 8.89,-1.27; VBUS 8.89,24.13; VSYS 8.89,21.59
SOT95P280X100-6N = smd 1.05 x 0.55: 1 -1.3,0.95; 2 -1.3,0; 3 -1.3,-0.95; 4 1.3,-0.95; 5 1.3,0; 6 1.3,0.95

### Placement (x,y rotation side)
C1  78.8,38.3 270 top
C2  20.7,12.6 180 bottom
C3  32.8,20.1 270 bottom
C4  97.3,45.2 90 bottom
C5  26.9,5.5 90 bottom
C6  53.2,45.3 270 bottom
C7  29.7,11.6 180 bottom
C8  45.6,20.1 0 bottom
C9  30.8,17.9 270 bottom
C10  16.7,13 270 bottom
C11  65.9,36.1 270 top
C12  12.4,9.3 0 bottom
C13  14.5,15 270 bottom
C16  85.9,87.1 270 top
C20  94.54,88.12 90 top
C58  78.7,45.9 90 bottom
C62  88,87.4 270 top
C63  85.21,90.4 90 top
C64  88,90.4 90 top
CR1  93.2,45 270 bottom
CR3  57.3,45.2 270 bottom
D2  54,54.4 90 bottom
D4  124.4,16.1 180 top
D5  114.6,18 270 top
D7  73.8,45.7 0 bottom
DISPLAY  25,22 0 top
DISPLAY1  125,22 0 top
DZ1  85.7,84.4 180 top
IC1  91.2,59.6 90 bottom
J2  113.5,9.3 0 top
J5  74.7,89.18 180 top
JP1  40.4,27.7 0 top
L1  93.17,83.65 180 top
LED1  86.93,79.87 0 top
LED2  81.28,79.87 0 top
LED3  74.93,79.87 0 top
LED4  69.08,79.87 0 top
LED5  63.03,79.87 0 top
LED6  70.9,40.9 0 top
MACHINE1  90.5,3.35 270 bottom
MACHINE3  70.5,3.35 270 bottom
Q1  88.06,46.37 0 bottom
Q2  62.46,46.57 0 bottom
R1  136.46,35.65 0 bottom
R2  113.35,33.45 180 bottom
R3  122.66,31.55 180 bottom
R4  126.97,31.65 180 bottom
R5  131.12,31.65 0 bottom
R6  136.61,33.25 0 bottom
R7  87.86,41.96 0 bottom
R8  87.86,43.75 0 bottom
R9  50.7,29.15 270 top
R10  48.48,8.99 0 bottom
R11  80.92,75.71 180 top
R12  74.67,75.81 180 top
R13  68.72,76.21 180 top
R14  62.57,76.21 180 top
R15  83.4,38.3 270 top
R16  81.2,38.3 90 top
R17  35,20.1 90 bottom
R18  37.4,20 90 bottom
R19  34.23,2.36 0 bottom
R20  22.59,32.04 90 top
R21  25.19,31.95 90 top
R22  27.69,31.86 90 top
R23  38.56,2.34 0 bottom
R24  30.29,31.87 90 top
R25  28.9,8.8 90 bottom
R26  26.4,8.7 270 bottom
R27  58.4,74.3 90 top
R28  14.53,5.61 270 bottom
R29  36.22,33.89 180 top
R30  21.22,2.41 0 bottom
R31  11.9,5.61 90 bottom
R32  44.54,11.14 180 bottom
R33  62.26,41.66 0 bottom
R34  62.26,43.75 0 bottom
R35  5.3,18.3 180 bottom
R36  9.3,18.3 180 bottom
R37  15.7,22.4 180 bottom
R38  15.7,24.4 180 bottom
R39  16.2,26.4 180 bottom
R40  15.7,28.4 180 bottom
R41  4.3,28.5 0 bottom
R42  3.7,26.4 0 bottom
R43  4.3,24.4 0 bottom
R44  4.2,22.3 0 bottom
R45  98,63.8 90 bottom
R46  57.8,55.4 90 bottom
R47  60.7,36.1 270 top
R48  63.4,36.2 90 top
R49  112.7,14.3 90 top
R50  120.6,15.9 270 top
R51  76.9,45.9 270 bottom
R52  69.6,46.8 180 bottom
R53  118.6,14 90 top
R54  116.1,14.3 90 top
R55  69.6,46 270 top
R56  59.1,49.8 180 bottom
R57  57.7,56.4 90 top
R58  90.5,49.3 0 bottom
R59  53.1,71.3 270 top
R60  97.1,71.8 180 top
R65  86.47,75.61 180 top
R66  36.21,35.79 180 top
R67  15.8,30.5 180 bottom
R68  4.4,30.5 0 bottom
RSENSE  52.4,12.7 90 bottom
S1  88.8,41.05 0 top
S3  64,41.05 0 top
TP1  64.6,61.4 0 bottom
TP2  62.2,58.4 0 top
TP3  62,64.4 0 top
TP4  99.1,71.8 0 top
TP5  53.2,73.6 0 top
TP6  53.1,48.7 0 top
TP7  96.8,48.7 0 top
TP8  53.1,41.8 0 top
TP9  97.1,41.8 0 top
U1  45.62,15.28 0 bottom
U2  35.7,8.6 0 bottom
U3  35.4,15.3 0 bottom
U4  20.8,8.6 0 bottom
U5  7.9,5.6 90 bottom
U6  8.1,13.3 180 bottom
U7  9.9,25.8 270 bottom
U8  118.8,15 90 bottom
U17  91.14,89.97 270 top

### Tracks (layer width: path | path; a pad name or v marks a point on that pad's centre or on a via)
3V3  (via drill 0.35, 1.5 pad 2.5)
  Bottom 0.508: U7.1 15.53,33.07 17.83,33.07 20.12,35.36 DISPLAY.2 | U6.7 12.96,12.66 | 12.96,12.66 v12.99,12.7 | U5.7 8.54,9.73 | 8.54,9.73 v8.58,9.78 | U1.7 41.23,15.91 v41.2,15.94 41.2,18.1 42.1,19 C8.2 | v34.57,15.94 v34.56,15.93 U3.7 31.16,15.93 30.8,16.3 C9.2 | U2.7 31.3,9.23 v31.27,9.27 30.6,9.94 C7.2 | U4.7 16.61,9.23 v16.56,9.28 16.7,9.42 C10.2 | D2.2 v52.9,56.93 v52.89,56.94 | IC1.9 85.09,62.14 v85.07,62.12 | R45.1 v98,61.83 v98.01,61.82 | C6.2 54.66,44.4 55.91,43.16 CR3.2 57.3,41.55 56.94,41.19 53.71,41.19 TP8.TP | C4.1 95.94,44.3 94.59,42.95 CR1.2 93.2,41.66 93.5,41.36 96.66,41.36 TP9.TP | D7.2 72.05,43.8 v71.8,43.8 | R1.1 138.85,35.65 v138.9,35.6 | C13.2 14.5,13 14.16,12.66 12.96,12.66 | C12.2 10.9,9.3 10.46,9.73 8.54,9.73
  other vias: 53.1,41.8 97.1,41.8
  pour Top (isolate 0.254, rank 2): -3.6,-3.07 152.1,-3.07 152.1,101 -3.6,101
CS
  Top 0.508: DISPLAY.7 35.22,35.7 R66.2 R29.2
CS_2
  Bottom 0.508: DISPLAY1.7 135.51,35.7 R1.2 135.71,35.5 R6.2
D0
  Top 0.508: R20.2 22.59,35.63 DISPLAY.3
D0_2
  Bottom 0.508: DISPLAY1.3 120.96,34 119.5,34 118.95,33.45 R2.2
D1
  Top 0.508: DISPLAY.4 R21.2
D1_2
  Bottom 0.508: R3.2 123.56,34.06 DISPLAY1.4
DC_2
  Bottom 0.508: R5.2 130.22,35.64 DISPLAY1.6
DSP_RST_1  (via drill 0.35)
  Top 0.508: R22.1 27.69,16.69 v27.4,16.4
  Route2 0.508: v27.4,16.4 28.8,16.4 31,14.2 91.5,14.2 99,21.7 v99,21.8
  Bottom 0.508: U8.GP20 105.28,21.8 v99,21.8
DSP_RST_2
  Bottom 0.508: R4.1 126.07,31.05 124.62,29.6 117.8,29.6 114.99,26.79 U8.GP22
GAIN
  Bottom 0.508: U2.3 41.13,7.96 | 41.13,7.96 43.05,7.96 43.64,8.56 R32.1 | U1.6 40.35,14.64 | 40.35,14.64 37.89,14.64 U3.3 | 40.35,14.64 40.35,8.75 41.13,7.96
GAL_1-  (via drill 1.5 pad 2.5)
  Top 0.508: TP6.TP v53.1,48.8
  Bottom 0.508: CR3.1 55.95,47.24 54.91,46.2 C6.1 | 57.55,47.49 CR3.1 | CR3.1 55.74,48.8 v53.1,48.8 | CR3.1 57.3,49.6 57.5,49.8 R56.1
GAL_2-  (via drill 1.5 pad 2.5)
  Top 0.508: TP7.TP v96.9,48.7
  Bottom 0.508: CR1.1 94.91,47.05 95.85,46.1 C4.2 | CR1.1 92.95,47.3 | CR1.1 93.2,49.1 | v96.9,48.7 96.25,49.35 93.45,49.35 93.2,49.1 | 93.2,49.1 93,49.3 R58.1
GND  (via drill 0.35, 1.5 pad 2.5)
  Top 0.508: C11.1 65.9,37.4 63.7,39.6 63.7,42.2 62.95,42.95 S3.1 59.76,42.95 v59.7,42.9 | C1.1 78.8,40.7 81.06,42.95 S1.1 84.34,42.95 v84.3,43 | D5.1 112.45,20 U8.GND@7 | D4.1 125.5,17.2 v126.3,18
  Top 0.7: U17.4 88,88.67
  Top 1.016: C62.1 87.7,88 C16.1 | C16.1 85.9,88.81 C63.1 C64.1 C62.1 | C62.1 88,88.67 | C16.1 84.63,88 v84.33,88.3 v83.8,87.77 83.8,84.8 DZ1.2
  Bottom 0.508: 52.3,8.99 RSENSE.P$1 | U1.4 50.02,13.38 50.9,12.5 50.9,8.99
  Bottom 1.016: R10.1 50.9,8.99 52.3,8.99
  Bottom 1.54: MACHINE1.4 MACHINE3.1 MACHINE3.4 MACHINE3.5 53.21,9.7 RSENSE.P$1 | MACHINE1.5 MACHINE1.4 | MACHINE1.4 MACHINE1.1
  other vias: 83.78,86.79 83.75,85.66 53.2,78.6 97.2,78.6 64.55,49.5 64.55,67.44
  pour Bottom (isolate 0.254, rank 2): -3.7,-3.1 152.1,-3.1 152.1,101 -3.7,101
I_AVG  (via drill 0.35)
  Route2 0.508: v20.4,4.7 27.4,11.7 110.58,11.7 120.07,21.19 U8.GP26_A0
  Bottom 0.508: U5.2 8.54,4.36 8.89,4.71 R31.1 R28.2 20.23,4.71 20.24,4.7 v20.4,4.7
I_COIL  (via drill 0.35, 1.5 pad 2.5)
  Top 0.508: v53.4,60 60.52,60 v62.05,58.47 62.12,58.4 TP2.TP
  Route15 0.508: v40.8,24.3 44.6,24.3 49,28.7 50.5,28.7 56.43,34.63 56.43,56.97 v53.4,60
  Bottom 0.508: U3.6 30.12,14.66 29.36,15.43 29.36,20.45 29.91,21 C3.1 R17.2 35,21.3 36.3,22.6 36.3,23.7 36.9,24.3 v40.8,24.3
I_CURRENT  (via drill 1.5 pad 2.5)
  Bottom 0.508: R46.2 57.8,60 59.4,61.6 64.4,61.6 v64.55,61.45 TP1.TP
I_DK  (via drill 0.35, 1.5 pad 2.5)
  Top 0.508: v53.4,64.2 53.6,64.4 TP3.TP 62.02,64.4 v62.05,64.42
  Route2 0.508: v18.1,19.8 26.4,19.8 42.6,36 49.5,36 51.2,37.7 51.2,62 v53.4,64.2
  Bottom 0.508: R36.2 11.76,18.3 | U6.6 11.96,13.93 12.82,14.8 12.82,17.24 11.76,18.3 | 11.76,18.3 16.6,18.3 v18.1,19.8
I_NORMAL
  Bottom 0.508: U5.3 7.26,1.42 7.34,1.35 17.3,1.35 18.36,2.41 R30.2
I_SENSE  (via drill 0.35)
  Route2 0.508: v59.8,54.5 60.2,54.1 60.2,48.1 62.4,45.9 84.8,45.9 v96.7,34
  Route15 0.508: v96.7,34 97.2,33.5 127.69,33.5 U8.GP28_A2
  Bottom 0.508: D2.3 57.7,54.4 R46.1 v59.8,54.5
LED_DUTY  (via drill 1.5 pad 2.5)
  Top 0.508: v97.2,75.4 98,74.6 R60.1 TP4.TP
LED_HZ  (via drill 1.5 pad 2.5)
  Top 0.508: R59.1 53.1,73.5 TP5.TP v53.2,75.5
MISO  (via drill 0.35)
  Top 0.508: R24.1 30.29,27.57 32.66,25.2 v36,25.2
  Route2 0.508: v133.5,33.2 132.72,33.98 112.5,33.98 111.28,35.2 v111.1,35.2 | U8.GP16 94.37,23.89 89.98,19.5 41.7,19.5 v36,25.2
  Bottom 0.508: U8.GP16 94.67,29.97 99.9,35.2 v111.1,35.2 | v133.5,33.2 132.02,31.72 R5.1
MOSI  (via drill 0.35)
  Top 0.508: R21.1 25.19,15.8 v25.3,15.8
  Route2 0.508: U8.GP19 93.54,12.6 28.5,12.6 v25.3,15.8
  Bottom 0.508: U8.GP19 104.83,28.33 108.4,31.9 121.41,31.9 R3.1
N$1
  Top 0.508: R49.2 R54.2 115.7,15.6 D5.3 115.7,18.8 116.7,19.8 128.5,19.8 130.23,18.07 U8.GP4
N$2
  Bottom 0.508: Q2.1 63.16,45.59 R34.1 R33.1
N$3
  Bottom 0.508: Q1.1 88.76,45.4 R8.1 R7.1
N$4
  Bottom 0.406: R32.2 45.44,10.16 46.61,8.99 R10.2
  Bottom 0.508: R32.2 45.44,15.18 46.17,15.91 U1.2
N$5
  Bottom 0.508: U6.3 7,13.93 7.26,13.68 U5.6 7.26,6.82 7.58,6.5 11.89,6.5 R31.2
N$6
  Top 0.508: R65.2 85.66,77.68 LED1.A
N$7
  Top 0.508: DISPLAY.6 R24.2
N$8
  Bottom 0.508: IC1.22 95.16,59.6 92.57,62.19 92.57,75.13 89.6,78.1 83.32,78.1 82.52,78.9 82.55,78.93 LED2.K
N$9
  Top 0.508: R11.2 LED2.A
N$10
  Bottom 0.508: IC1.23 95.26,58.33 91.34,62.25 91.34,74.9 89.22,77.02 77.65,77.02 76.2,78.47 LED3.K
N$11
  Top 0.508: R13.2 LED4.A
N$12
  Bottom 0.508: LED4.K 70.35,77.57 71.82,76.1 88.78,76.1 90.23,74.65 90.23,58.83 88.46,57.06 IC1.5
N$13
  Top 0.508: R14.2 61.72,79.83 LED5.A
N$14
  Bottom 0.508: LED5.K 64.3,76.47 65.57,75.2 88.47,75.2 89.38,74.29 89.38,59.68 88,58.3 86.45,58.3 IC1.6
N$15
  Top 0.508: S1.3 83.45,39.15 R15.1 R16.2
N$16
  Bottom 0.508: R41.2 2.8,27.9 R42.2 2.8,25 R43.2 3.3,24.3 R44.2 3.3,22.22 6.2,19.32 | R35.2 6.2,19.32 | R35.2 R36.1 | 6.2,19.32 6.39,19.51 15.36,19.51 16.6,20.75 R37.2 R38.2 17.1,24.9 R39.2 | R40.2 17.1,27.9 R39.2 | U6.2 4.22,12.66 3.76,13.13 3.76,15.55 4.82,16.61 6.21,16.61 R35.2 | R39.2 40.37,26.4 JP1.1
N$17
  Bottom 0.508: U7.6 13.47,23.9 13.75,23.62 13.75,23.25 14.6,22.4 R37.1
N$18
  Bottom 0.508: R38.1 14.58,24.4 13.81,25.16 U7.5
N$19
  Bottom 0.508: U7.4 15.27,26.44 R39.1
N$20
  Bottom 0.508: R40.1 14.6,28.4 13.9,27.7 U7.3
N$21
  Bottom 0.508: U7.14 6.39,27.7 5.6,28.5 R41.1
N$22
  Bottom 0.508: R42.1 7.07,26.4 U7.13
N$23
  Bottom 0.508: U7.12 6.43,25.16 5.67,24.4 R43.1
N$24
  Bottom 0.508: R44.1 5.1,22.35 6.21,23.46 6.21,23.76 6.34,23.9 U7.11
N$25  (via drill 0.35)
  Top 0.508: R59.2 v53.1,69.1
  Route15 0.508: v85.05,54.55 83.61,55.99 83.61,74.09 83.19,74.51 82.3,75.4 59.4,75.4 v53.1,69.1
  Bottom 0.508: IC1.3 85.12,54.52 85.1,54.5 v85.05,54.55
N$26
  Bottom 0.508: R68.1 5.3,30.27 6.59,28.98 U7.15
N$27  (via drill 0.35)
  Top 0.508: R60.2 91.1,66.7 91.1,57.1 v91,57.1
  Bottom 0.508: v91,57.1 91,56.7 90.09,55.79 IC1.4
N$28
  Top 0.508: R55.2 69.63,45.07 LED6.A
N$29
  Bottom 0.508: C2.1 19.89,12.51 19.89,9.35 | 19.89,9.35 19.89,8.27 19.59,7.96 U4.6 14.53,7.96 R28.1 | U4.2 20,9.23 19.89,9.35
N$30
  Bottom 0.508: R25.2 28.8,9.6 R26.1 26.4,11.98 25.78,12.6 C2.2
N$31
  Bottom 0.508: U4.3 26.23,7.96 R26.2 26.4,6.9 C5.2
N$32
  Bottom 0.508: R30.1 29.09,2.41 | R19.2 29.09,2.36 29.09,2.41 | U2.6 33.16,7.9 R25.1 29.09,7.71 29.09,2.41
N$33
  Bottom 0.508: U2.2 36.13,9.23 35.13,8.23 R19.1 37.64,2.36 R23.2
N$34
  Bottom 0.508: U3.2 39.38,15.93 39.7,16.25 39.7,18.47 39.07,19.1 R18.1 35.1,19.1 R17.1 C3.2
N$36
  Top 0.508: U8.GP5 127.69,13.01 125.7,15 D4.3 R50.2 118.7,15 R53.2
N$37  (via drill 0.35)
  Top 0.508: LED6.K 78.57,47.3 v81.4,47.3
  Route2 0.508: v81.4,47.3 86.7,47.3 v93.9,54.5
  Bottom 0.508: v93.9,54.5 95.96,54.5 IC1.26
N$38
  Top 0.508: R48.2 60.8,37.1 R47.1 59.7,37 59.3,37.4 59.3,38.6 59.84,39.15 S3.3
N$40
  Bottom 0.508: U7.2 13.6,28.98 13.9,29.28 13.9,29.9 14.5,30.5 R67.1
N$41
  Bottom 0.508: R56.2 61.6,49.8 62.46,48.94 Q2.3
N$42
  Top 0.508: R12.2 73.81,79.72 LED3.A
N$44
  Bottom 0.508: Q1.3 88.06,48.76 88.6,49.3 R58.2
N$45
  Bottom 0.508: R45.2 96,64.7 IC1.18
N$46
  Bottom 0.508: JP1.2 40.58,29.15 R9.2 R9.3
N$59
  Bottom 0.508: IC1.21 95.16,60.87 93.61,62.42 93.61,75.45 89.05,80.01 88.34,80.01 LED1.K
N$69
  Top 0.508: C20.2 93.39,89.02 93.04,88.67 U17.6
N$70
  Top 0.508: U17.5 91.14,87.33 91.25,87.22 C20.1 94.54,83.68 L1.1
PALANCA_MACHINE  (via drill 0.35, 1.5 pad 2.5)
  Route15 0.508: v62.05,70.41 62.05,69.45 58.3,65.7 58.3,24.5 61.2,21.6 v84.7,21.6
  Bottom 0.508: v84.7,21.6 88.2,21.6 97.1,12.7 107.37,12.7 U8.GP11
PALANCA_TRACK  (via drill 0.35, 1.5 pad 2.5)
  Route15 0.508: v84.9,23.7 84.85,23.75 84.85,33.25 83.5,34.6 64.3,34.6 61.09,37.81 61.09,43.42 60.2,44.31 60.2,51.9 60.79,52.49 v62.05,52.49
  Bottom 0.508: U8.GP10 109.91,16.1 96.9,16.1 89.3,23.7 v84.9,23.7
PLNC_MACHINE_+  (via drill 1.5 pad 2.5)
  Top 0.508: v64.55,73.4 R27.1
PLNC_TRACK_+  (via drill 1.5 pad 2.5)
  Top 0.508: v64.55,55.46 57.74,55.46 R57.1
PWM_GALGA_1  (via drill 0.35)
  Top 0.508: v61.6,23.3 v61.6,1.9
  Route2 0.508: v59.6,41.4 59.6,25.3 v61.6,23.3
  Bottom 0.508: U8.GP2 135.31,2.48 133.97,1.15 62.25,1.15 61.6,1.8 v61.6,1.9 | R33.2 59.86,41.66 v59.6,41.4
PWM_GALGA_2
  Bottom 0.508: R7.2 86.96,29.64 96.8,19.8 136,19.8 136,11.24 132.77,8.01 U8.GP3
RST
  Top 0.508: DISPLAY.5 27.74,32.81 R22.2
RST_2
  Bottom 0.508: R4.2 127.87,35.57 DISPLAY1.5
SAVE
  Top 0.508: C1.2 R16.1 81.2,36.3 81.54,35.96 85.01,35.96 85.01,28.49 97.21,16.29 U8.GP14
SCK  (via drill 0.35)
  Top 0.508: R20.1 22.59,16.51 25.6,13.5 v29.2,13.5
  Route2 0.508: v29.2,13.5 29.3,13.4 92.5,13.4 102.29,23.19 U8.GP18
  Bottom 0.508: U8.GP18 102.29,28.99 106.75,33.45 R2.1
SCL  (via drill 0.35)
  Top 0.508: J2.3 118.58,13.08 R53.1
  Route15 0.508: 87.45,16.42 85.68,18.2 13.7,18.2 v2,29.9 | v87.9,65.9 87.45,65.45 87.45,16.42 | 87.45,16.42 87.45,15.12 94.96,7.62 116.9,7.62 J2.3
  Bottom 0.508: v2,29.9 2.6,30.5 R68.2 | v87.9,65.9 87.85,65.95 IC1.12
SDA  (via drill 0.35)
  Top 0.508: J2.2 116.04,13.34 R54.1
  Route15 0.508: J2.2 111.94,13.4 96,13.4 88.8,20.6 88.8,66.5 88.1,67.2 v84.9,67.2 86.4,65.7 86.4,21.6 84.5,19.7 28.5,19.7 v18.1,30.1
  Bottom 0.508: v84.9,67.2 84.92,67.22 IC1.13 | v18.1,30.1 17.7,30.5 R67.2
SS  (via drill 0.35)
  Top 0.508: R29.1 37.12,22.68 v37.2,22.6
  Route2 0.508: v103,31.9 103.1,31.9 103.4,32.2 137.7,32.2 v138.7,33.2 | U8.GP17 97.21,22.99 92.82,18.6 41.2,18.6 v37.2,22.6
  Bottom 0.508: U8.GP17 97.21,28.41 100.7,31.9 v103,31.9 | v138.7,33.2 137.56,33.2 R6.1
TRACK
  Top 0.508: R48.1 65.8,35.3 C11.2 66.2,34.9 82.7,34.9 83.95,33.66 83.95,28.05 94.67,17.33 U8.GP15
V+  (via drill 0.35, 1.5 pad 2.5)
  Top 0.508: J5.1 82.19,89.18 84.31,91.3 C63.2 C64.2 90.16,91.3 U17.3 90.19,92.17 90.67,92.64 91.14,92.17 U17.2
  Top 1.016: v58.6,80.9 58.6,86.7 61.08,89.18 J5.1
  Route2 1.016: v58.6,80.9 58.6,46.7 60.5,44.8 v66.3,44.8 62.3,44.8 61.2,43.7 61.2,29.1 62.3,28 v64.5,28
  Bottom 0.508: R52.1 68.3,46.8 v66.3,44.8
  other vias: 59.5,82.4 57.7,82 59.8,79.4 57.5,79.4 58.6,78.7
  pour Top (isolate 0.254): 56.9,82.9 56.9,78.2 60.3,78.2 60.3,83 56.9,83
  pour Route2 (isolate 0.254): 56.6,83.2 56.6,78 60.5,78 60.5,83.2
V+_1  (via drill 1.5 pad 2.5)
  Top 1.016: v64.5,32 60.8,32 56.43,27.63 56.43,18.72 MACHINE3.6
V+_2  (via drill 1.5 pad 2.5)
  Top 1.016: v64.5,24 64.5,21.32 66.2,19.62 74.01,19.62 77.58,16.05 MACHINE1.6
VIN-  (via drill 0.35)
  Route2 1.54: J5.3 J5.2 58.34,85.48 55.92,83.06 55.92,24.49 v52.42,20.99
  Bottom 0.508: U1.3 51.95,14.64 52.4,15.1 RSENSE.P$2 52.5,16.61 | v54.2,22.3 54.2,22.4
  Bottom 1.54: v52.42,20.99 52.3,20.87 52.3,16.61 RSENSE.P$2 53.71,16.51 54.2,17 | 54.2,22.4 54.2,17 | 54.2,17 55.9,18.7 v55.9,30.2
VIN_SENSE  (via drill 0.35)
  Route2 0.508: U8.GP27_A1 115.9,30.6 89.9,30.6 80.9,39.6 v80.9,40.79
  Bottom 0.508: R52.2 D7.3 R51.1 C58.2 80,46.8 80.9,45.9 v80.9,40.79

### Text on the board
tPlace: GND | GND | LED | + | D | LED | PLNC_MCHN | - | I_DK | I_C | D | I_COIL | + | - | - | - | + | + | GND | GND | GND | 3v3